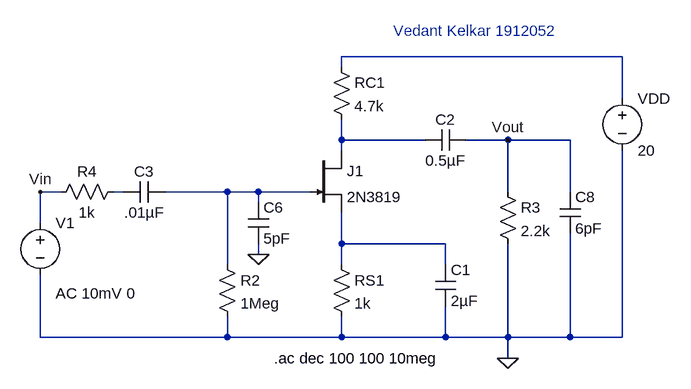
[diagram p0: schematic ECAD_exp2.asc]
ECAD_exp2.asc, the LTspice schematic file:
Version 4
SHEET 1 880 680
WIRE 640 -32 208 -32
WIRE 208 -16 208 -32
WIRE 640 32 640 -32
WIRE 208 96 208 64
WIRE 336 96 208 96
WIRE 464 96 400 96
WIRE 560 96 464 96
WIRE 208 112 208 96
WIRE -224 176 -256 176
WIRE -128 176 -144 176
WIRE 32 176 -64 176
WIRE 80 176 32 176
WIRE 160 176 80 176
WIRE 464 176 464 96
WIRE 560 176 560 96
WIRE 80 192 80 176
WIRE -256 224 -256 176
WIRE 208 256 208 208
WIRE 368 256 208 256
WIRE 80 272 80 256
WIRE 32 288 32 176
WIRE 208 288 208 256
WIRE 368 288 368 256
WIRE -256 400 -256 304
WIRE 32 400 32 368
WIRE 32 400 -256 400
WIRE 208 400 208 368
WIRE 208 400 32 400
WIRE 368 400 368 352
WIRE 368 400 208 400
WIRE 464 400 464 256
WIRE 464 400 368 400
WIRE 560 400 560 240
WIRE 560 400 464 400
WIRE 640 400 640 112
WIRE 640 400 560 400
WIRE 464 432 464 400
FLAG -256 176 Vin
FLAG 464 96 Vout
FLAG 464 432 0
FLAG 80 272 0
SYMBOL res 192 -32 R0
SYMATTR InstName RC1
SYMATTR Value 4.7k
SYMBOL res 16 272 R0
SYMATTR InstName R2
SYMATTR Value 1Meg
SYMBOL res 192 272 R0
SYMATTR InstName RS1
SYMATTR Value 1k
SYMBOL res 448 160 R0
SYMATTR InstName R3
SYMATTR Value 2.2k
SYMBOL cap 352 288 R0
SYMATTR InstName C1
SYMATTR Value 2µF
SYMBOL cap 400 80 R90
WINDOW 0 0 32 VBottom 2
WINDOW 3 32 32 VTop 2
SYMATTR InstName C2
SYMATTR Value 0.5µF
SYMBOL cap -64 160 R90
WINDOW 0 0 32 VBottom 2
WINDOW 3 32 32 VTop 2
SYMATTR InstName C3
SYMATTR Value .01µF
SYMBOL voltage -256 208 R0
WINDOW 123 24 124 Left 2
WINDOW 39 0 0 Left 0
SYMATTR Value2 AC 10mV 0
SYMATTR InstName V1
SYMATTR Value ""
SYMBOL voltage 640 16 R0
WINDOW 123 0 0 Left 0
WINDOW 39 0 0 Left 0
SYMATTR InstName VDD
SYMATTR Value 20
SYMBOL res -128 160 R90
WINDOW 0 0 56 VBottom 2
WINDOW 3 32 56 VTop 2
SYMATTR InstName R4
SYMATTR Value 1k
SYMBOL cap 64 192 R0
SYMATTR InstName C6
SYMATTR Value 5pF
SYMBOL cap 544 176 R0
SYMATTR InstName C8
SYMATTR Value 6pF
SYMBOL njf 160 112 R0
SYMATTR InstName J1
SYMATTR Value 2N3819
TEXT 104 432 Left 2 !.ac dec 100 100 10meg
TEXT 288 -72 Left 2 ;Vedant Kelkar 1912052

The netlist it stands for:
* ECAD_exp2.asc
RC1 N001 N002 4.7k
R2 N004 0 1Meg
RS1 N005 0 1k
R3 Vout 0 2.2k
C1 N005 0 2µF
C2 Vout N002 0.5µF
C3 N004 N003 .01µF
V1 Vin 0 AC 10mV 0
VDD N001 0 20
R4 N003 Vin 1k
C6 N004 0 5pF
C8 Vout 0 6pF
J1 N002 N004 N005 2N3819
.model NJF NJF
.model PJF PJF
.lib standard.jft
.ac dec 100 100 10meg
* Vedant Kelkar 1912052
.backanno
.end